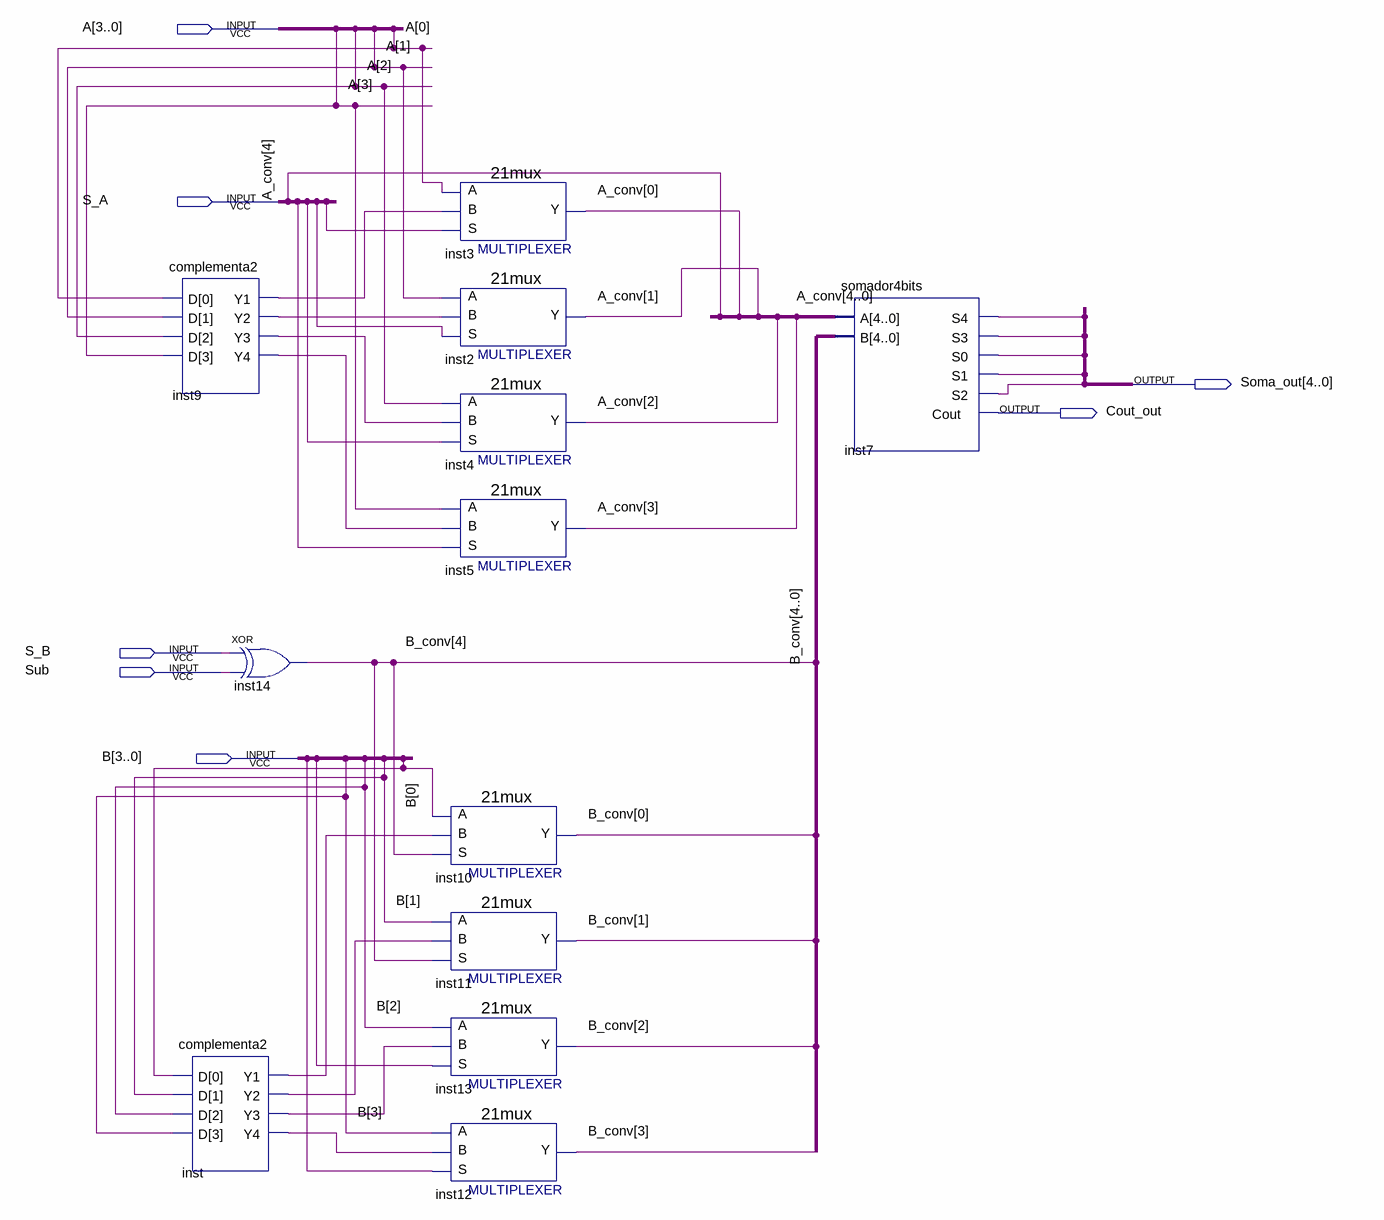
[diagram p0: schematic sheet]
// Quartus schematic somadorsubtrtor.bdf as structural Verilog: 12 symbols, 7 pins
module somadorsubtrtor (
  input  [3:0] A,
  input  S_A,
  input  S_B,
  input  Sub,
  input  [3:0] B,
  output [4:0] Soma_out,
  output Cout_out
);

  wire inst7_s0, inst7_s1, inst7_s2, inst7_s3, inst7_s4, inst9_y1, inst9_y2, inst9_y3, inst9_y4, inst_y1,
       inst_y2, inst_y3, inst_y4, undriven, undriven_2;
  wire [4:0] A_conv, B_conv;

  complementa2 inst9 (.D(A), .Y1(inst9_y1), .Y2(inst9_y2), .Y3(inst9_y3), .Y4(inst9_y4));
  complementa2 inst (.D(B), .Y1(inst_y1), .Y2(inst_y2), .Y3(inst_y3), .Y4(inst_y4));
  xor inst14 (B_conv[4], S_B, Sub);
  \21mux  inst3 (.S(S_A), .B(inst9_y1), .A(A[0]), .Y(A_conv[0]));
  \21mux  inst2 (.S(S_A), .B(inst9_y2), .A(A[1]), .Y(A_conv[1]));
  \21mux  inst4 (.S(S_A), .B(inst9_y3), .A(A[2]), .Y(A_conv[2]));
  \21mux  inst5 (.S(S_A), .B(inst9_y4), .A(A[3]), .Y(A_conv[3]));
  \21mux  inst10 (.S(B_conv[4]), .B(inst_y1), .A(B[0]), .Y(B_conv[0]));
  \21mux  inst11 (.S(B_conv[4]), .B(inst_y2), .A(B[1]), .Y(B_conv[1]));
  \21mux  inst13 (.S(undriven), .B(inst_y3), .A(B[2]), .Y(B_conv[2]));
  \21mux  inst12 (.S(undriven_2), .B(inst_y4), .A(B[3]), .Y(B_conv[3]));
  somador4bits inst7 (
    .A(A_conv), .B(B_conv), .S4(inst7_s4), .S3(inst7_s3), .S0(inst7_s0), .S1(inst7_s1), .S2(inst7_s2),
    .Cout(Cout_out));
endmodule
